# Altium schematic sheet HVPS - LT3751.SchDoc
size 584 x 381 mm; SheetNumber: 1; SheetTotal: 1
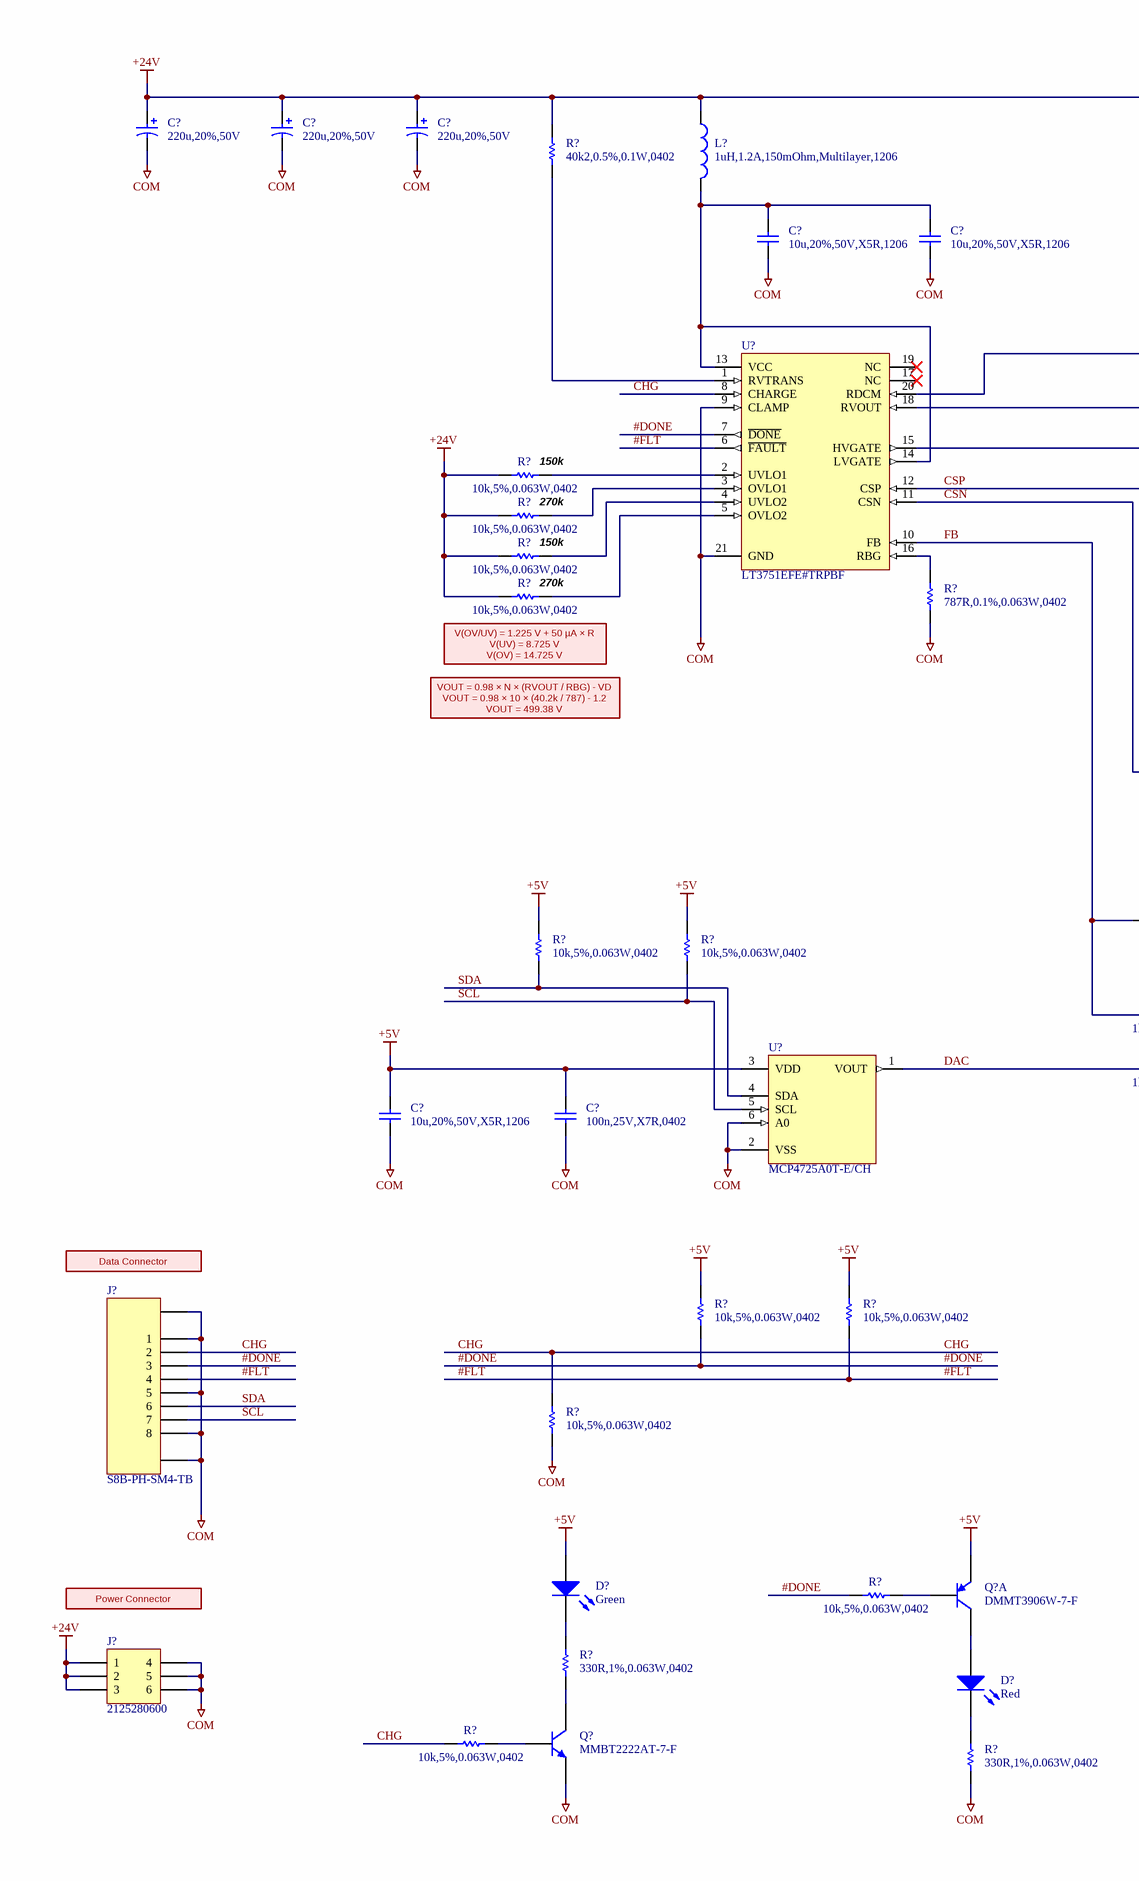
[diagram p0: HVPS - LT3751.SchDoc, left]
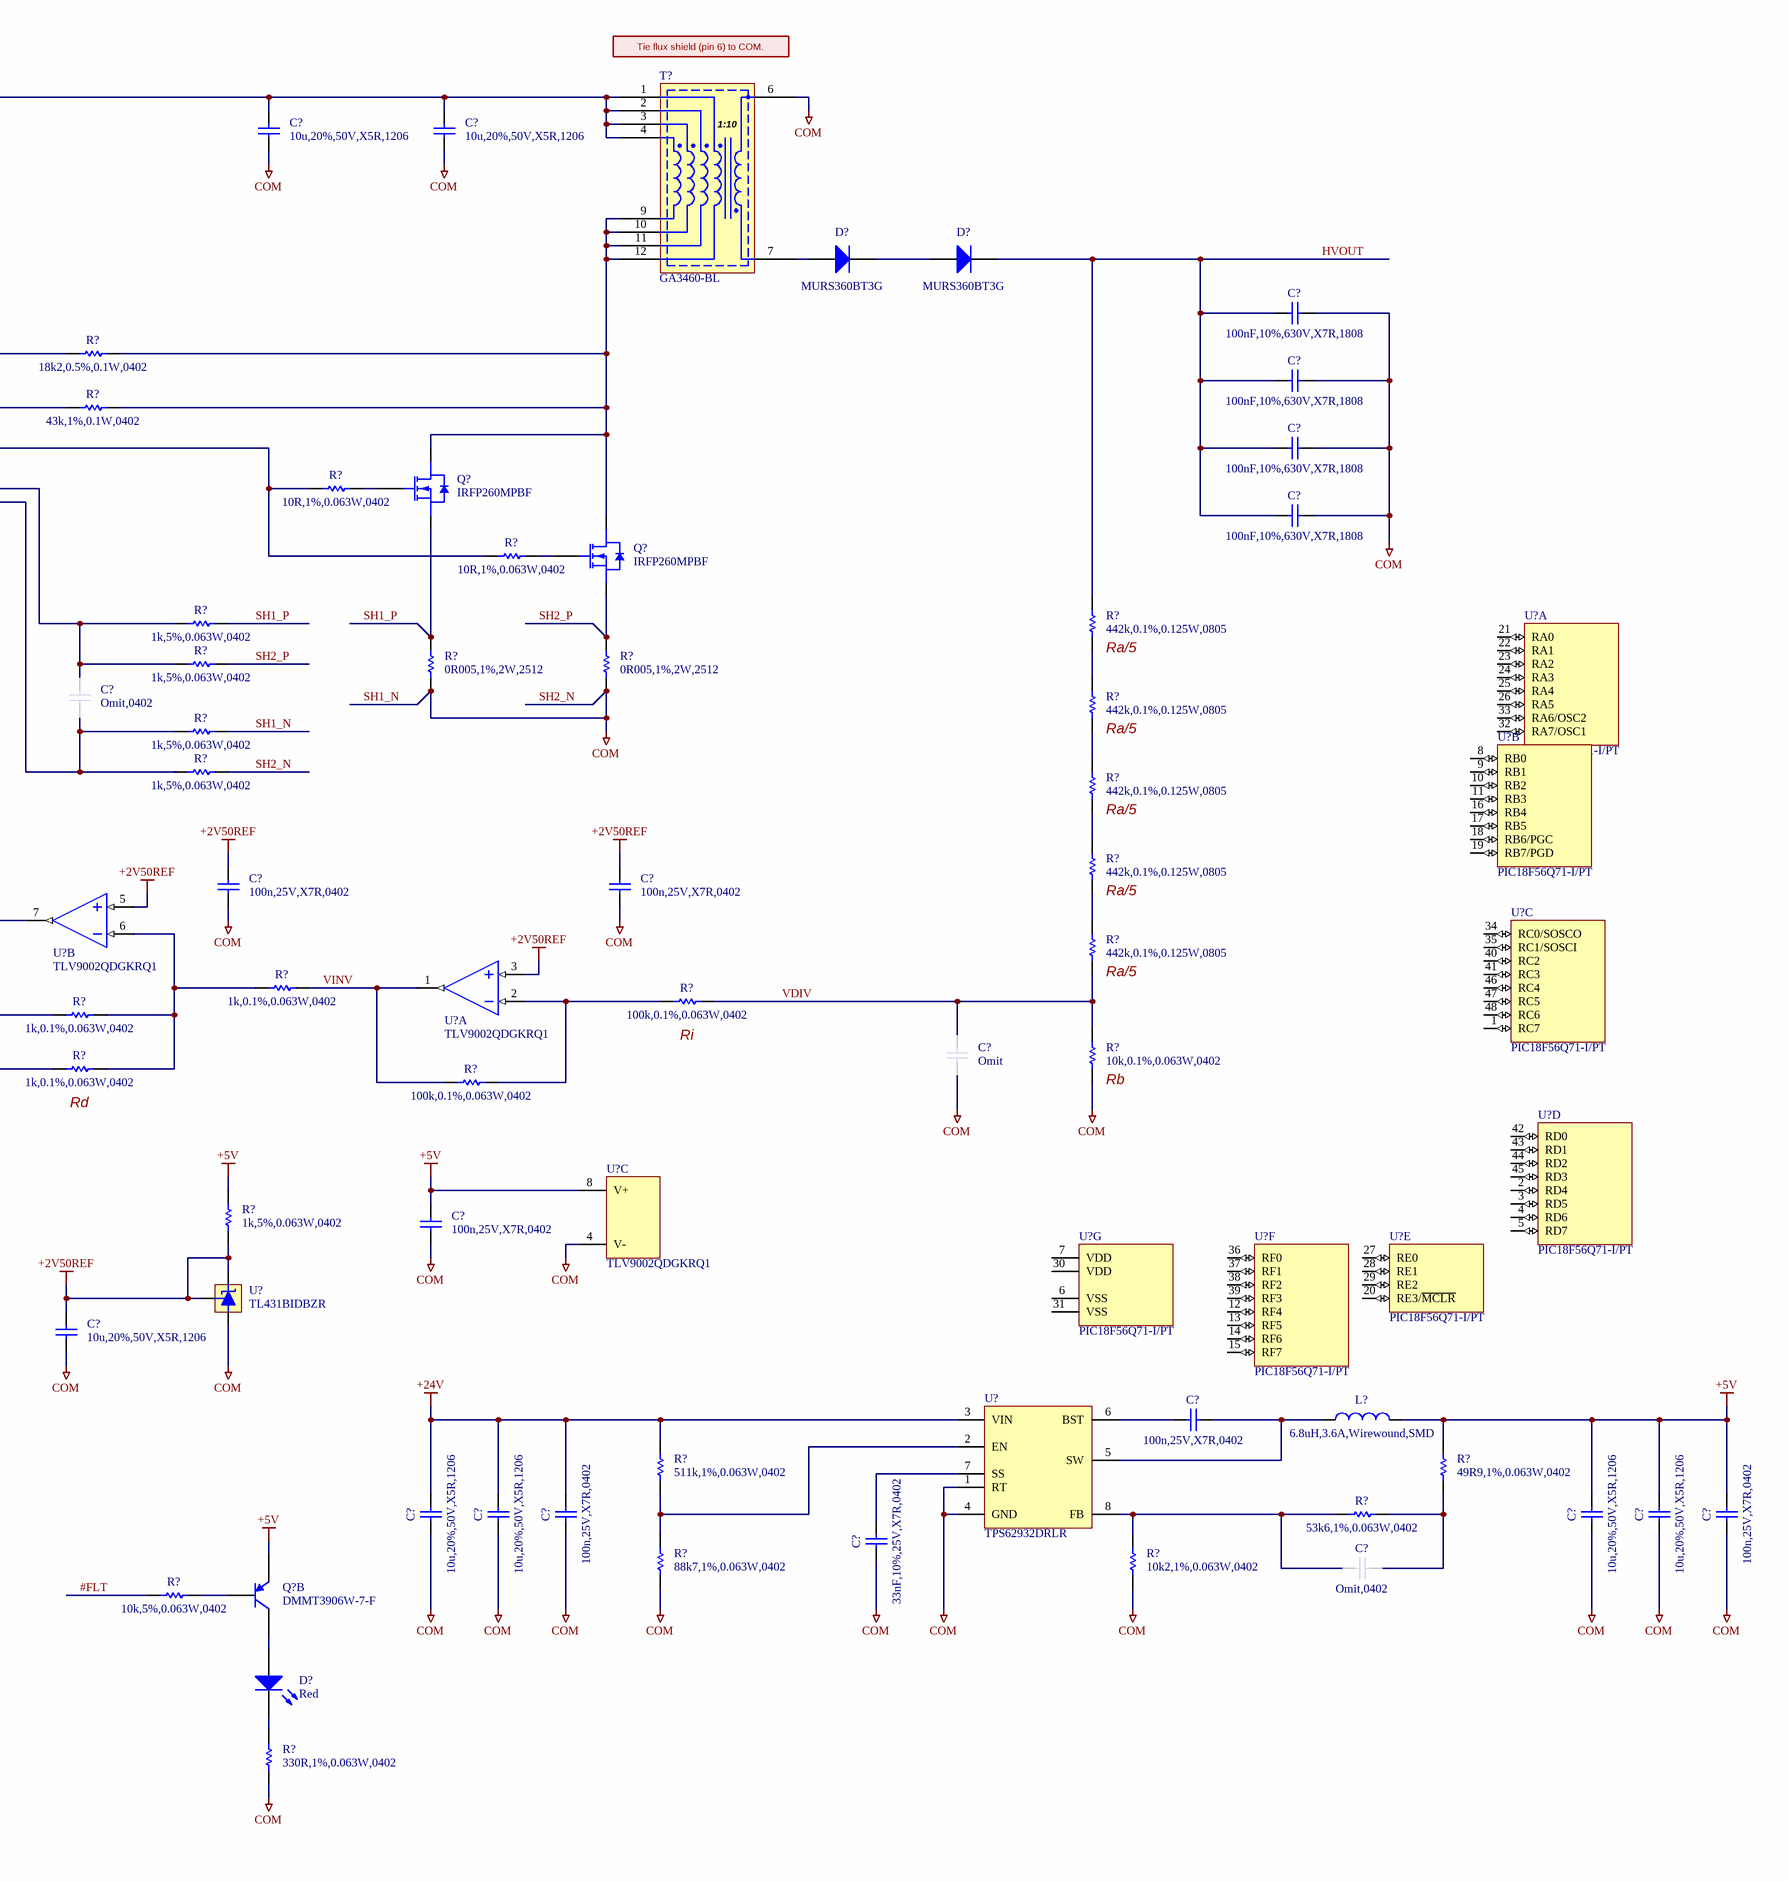
[diagram p1: HVPS - LT3751.SchDoc, right]

## Parts
(Parts that share a designator on the sheet are numbered #1, #2 ... from top to bottom, then left to right.)
C?#1  220u,20%,50V  [CAPPR500W60D1000H1600B]
C?#2  220u,20%,50V  [CAPPR500W60D1000H1600B]
C?#3  220u,20%,50V  [CAPPR500W60D1000H1600B]
C?#4  10u,20%,50V,X5R,1206  [CAPC3216X16N]
C?#5  10u,20%,50V,X5R,1206  [CAPC3216X16N]
C?#6  10u,20%,50V,X5R,1206  [CAPC3216X16N]
C?#7  10u,20%,50V,X5R,1206  [CAPC3216X16N]
C?#8  100nF,10%,630V,X7R,1808  [KEMET_PKG_LC]
C?#9  100nF,10%,630V,X7R,1808  [KEMET_PKG_LC]
C?#10  100nF,10%,630V,X7R,1808  [KEMET_PKG_LC]
C?#11  100nF,10%,630V,X7R,1808  [KEMET_PKG_LC]
C?#12  Omit,0402  [CAPC1005X06N]  (no BOM)
C?#13  100n,25V,X7R,0402  [CAPC1005X06N]
C?#14  100n,25V,X7R,0402  [CAPC1005X06N]
C?#15  Omit  [CAPC_0805]  (no BOM)
C?#16  10u,20%,50V,X5R,1206  [CAPC3216X16N]
C?#17  100n,25V,X7R,0402  [CAPC1005X06N]
C?#18  100n,25V,X7R,0402  [CAPC1005X06N]
C?#19  10u,20%,50V,X5R,1206  [CAPC3216X16N]
C?#20  100n,25V,X7R,0402  [CAPC1005X06N]
C?#21  10u,20%,50V,X5R,1206  [CAPC3216X16N]
C?#22  10u,20%,50V,X5R,1206  [CAPC3216X16N]
C?#23  100n,25V,X7R,0402  [CAPC1005X06N]
C?#24  10u,20%,50V,X5R,1206  [CAPC3216X16N]
C?#25  10u,20%,50V,X5R,1206  [CAPC3216X16N]
C?#26  100n,25V,X7R,0402  [CAPC1005X06N]
C?#27  33nF,10%,25V,X7R,0402  [CAPC1005X06N]
C?#28  Omit,0402  [CAPC1005X06N]  (no BOM)
D?#1  MURS360BT3G  [ONSEMI_SMB]
D?#2  MURS360BT3G  [ONSEMI_SMB]
D?#3  Green  [LITE-ON_LTST-C190KGKT]
D?#4  Red  [LITE-ON_LTST-C190KRKT]
D?#5  Red  [LITE-ON_LTST-C190KRKT]
J?#1  S8B-PH-SM4-TB  [JST_S8B-PH-SM4-TB]
J?#2  2125280600  [MOLEX_2125280600]
L?#1  1uH,1.2A,150mOhm,Multilayer,1206  [MURATA_LQM31]
L?#2  6.8uH,3.6A,Wirewound,SMD  [BOURNS_SRN6045TA-6R8M]
Q?#1  IRFP260MPBF  [INFINEON_PKG_TO247AD]
Q?#2  IRFP260MPBF  [INFINEON_PKG_TO247AD]
Q?#3  DMMT3906W-7-F  [DIODES_SOT363]  (part A of 2)
Q?#4  DMMT3906W-7-F  [DIODES_SOT363]  (part B of 2)
Q?#5  MMBT2222AT-7-F  [SOTFL50P160X90-3N]
R?#1  40k2,0.5%,0.1W,0402  [RESC1005X04N]
R?#2  18k2,0.5%,0.1W,0402  [RESC1005X04N]
R?#3  43k,1%,0.1W,0402  [RESC1005X04N]
R?#4  10k,5%,0.063W,0402  [RESC1005X04N]
R?#5  10R,1%,0.063W,0402  [RESC1005X04N]
R?#6  10k,5%,0.063W,0402  [RESC1005X04N]
R?#7  10k,5%,0.063W,0402  [RESC1005X04N]
R?#8  10R,1%,0.063W,0402  [RESC1005X04N]
R?#9  10k,5%,0.063W,0402  [RESC1005X04N]
R?#10  787R,0.1%,0.063W,0402  [RESC1005X04N]
R?#11  1k,5%,0.063W,0402  [RESC1005X04N]
R?#12  442k,0.1%,0.125W,0805  [RESC2012X07N]
R?#13  1k,5%,0.063W,0402  [RESC1005X04N]
R?#14  0R005,1%,2W,2512  [OHMITE_PKG_MCS3264]
R?#15  0R005,1%,2W,2512  [OHMITE_PKG_MCS3264]
R?#16  442k,0.1%,0.125W,0805  [RESC2012X07N]
R?#17  1k,5%,0.063W,0402  [RESC1005X04N]
R?#18  1k,5%,0.063W,0402  [RESC1005X04N]
R?#19  442k,0.1%,0.125W,0805  [RESC2012X07N]
R?#20  442k,0.1%,0.125W,0805  [RESC2012X07N]
R?#21  10k,5%,0.063W,0402  [RESC1005X04N]
R?#22  10k,5%,0.063W,0402  [RESC1005X04N]
R?#23  442k,0.1%,0.125W,0805  [RESC2012X07N]
R?#24  1k,0.1%,0.063W,0402  [RESC1005X04N]
R?#25  100k,0.1%,0.063W,0402  [RESC1005X04N]
R?#26  1k,0.1%,0.063W,0402  [RESC1005X04N]
R?#27  10k,0.1%,0.063W,0402  [RESC1005X04N]
R?#28  1k,0.1%,0.063W,0402  [RESC1005X04N]
R?#29  100k,0.1%,0.063W,0402  [RESC1005X04N]
R?#30  1k,5%,0.063W,0402  [RESC1005X04N]
R?#31  10k,5%,0.063W,0402  [RESC1005X04N]
R?#32  10k,5%,0.063W,0402  [RESC1005X04N]
R?#33  10k,5%,0.063W,0402  [RESC1005X04N]
R?#34  511k,1%,0.063W,0402  [RESC1005X04N]
R?#35  49R9,1%,0.063W,0402  [RESC1005X04N]
R?#36  53k6,1%,0.063W,0402  [RESC1005X04N]
R?#37  88k7,1%,0.063W,0402  [RESC1005X04N]
R?#38  10k2,1%,0.063W,0402  [RESC1005X04N]
R?#39  10k,5%,0.063W,0402  [RESC1005X04N]
R?#40  10k,5%,0.063W,0402  [RESC1005X04N]
R?#41  330R,1%,0.063W,0402  [RESC1005X04N]
R?#42  10k,5%,0.063W,0402  [RESC1005X04N]
R?#43  330R,1%,0.063W,0402  [RESC1005X04N]
R?#44  330R,1%,0.063W,0402  [RESC1005X04N]
T?  GA3460-BL  [COILCRAFT_GA3460-BL]
U?#1  LT3751EFE#TRPBF  [ANALOGDEVICES_FE]
U?#2  PIC18F56Q71-I/PT  [TSQFP50P900X900X120-48N]  (part A of 7)
U?#3  PIC18F56Q71-I/PT  [TSQFP50P900X900X120-48N]  (part B of 7)
U?#4  TLV9002QDGKRQ1  [SOP65P490X110-8]  (part B of 3)
U?#5  PIC18F56Q71-I/PT  [TSQFP50P900X900X120-48N]  (part C of 7)
U?#6  TLV9002QDGKRQ1  [SOP65P490X110-8]  (part A of 3)
U?#7  MCP4725A0T-E/CH  [SOTFL95P260X145-6]
U?#8  PIC18F56Q71-I/PT  [TSQFP50P900X900X120-48N]  (part D of 7)
U?#9  TLV9002QDGKRQ1  [SOP65P490X110-8]  (part C of 3)
U?#10  PIC18F56Q71-I/PT  [TSQFP50P900X900X120-48N]  (part G of 7)
U?#11  PIC18F56Q71-I/PT  [TSQFP50P900X900X120-48N]  (part F of 7)
U?#12  PIC18F56Q71-I/PT  [TSQFP50P900X900X120-48N]  (part E of 7)
U?#13  TL431BIDBZR  [SOT95P240X120-3N]
U?#14  TPS62932DRLR  [TEXASINSTRUMENTS_PKG_DRL0008A]

## Nets
+2V50REF: C?#13.2 C?#14.2 C?#19.2 R?#30.1 U?#4.5(IN2+) U?#6.3(IN1+) U?#13.1 U?#13.2
+5V: C?#16.2 C?#17.2 C?#18.2 C?#24.2 C?#25.2 C?#26.2 D?#3.A L?#2.2 Q?#3.4(E1) Q?#4.5(E2) R?#21.2 R?#22.2 R?#30.2 R?#31.2 R?#32.2 R?#35.2 U?#7.3(VDD) U?#9.8(V+)
+24V: C?#1.1 C?#2.1 C?#3.1 C?#4.2 C?#5.2 C?#21.2 C?#22.2 C?#23.2 J?#2.1 J?#2.2 J?#2.3 L?#1.1 R?#1.2 R?#4.1 R?#6.1 R?#7.1 R?#9.1 R?#34.2 T?.1 T?.2 T?.3 T?.4 U?#14.3(VIN)
SH1_N: C?#1.2 C?#2.2 C?#3.2 C?#4.1 C?#5.1 C?#6.1 C?#7.1 C?#8.1 C?#9.1 C?#10.1 C?#11.1 C?#13.1 C?#14.1 C?#15.1 C?#16.1 C?#17.1 C?#18.1 C?#19.1 C?#21.1 C?#22.1 C?#23.1 C?#24.1 C?#25.1 C?#26.1 C?#27.1 J?#1.0 J?#1.1 J?#1.5 J?#1.8 J?#2.4 J?#2.5 J?#2.6 Q?#5.2(E) R?#10.1 R?#14.1 R?#15.1 R?#17.2 R?#18.2 R?#27.1 R?#33.1 R?#37.1 R?#38.1 R?#43.1 R?#44.1 T?.6 U?#1.9(CLAMP) U?#1.21(GND) U?#7.2(VSS) U?#7.6(A0) U?#9.4(V-) U?#13.3 U?#14.1(RT) U?#14.4(GND)  [also labelled COM, SH2_N]
#DONE: J?#1.3 R?#31.1 R?#39.2 U?#1.7(~{DONE})
#FLT: J?#1.4 R?#32.1 R?#40.2 U?#1.6(~{FAULT})
CHG: J?#1.2 R?#33.2 R?#42.2 U?#1.8(CHARGE)
CSN: C?#12.1 R?#17.1 R?#18.1 U?#1.11(CSN)
CSP: C?#12.2 R?#11.1 R?#13.1 U?#1.12(CSP)
DAC: R?#28.2 U?#7.1(VOUT)
FB: R?#26.1 U?#1.10(FB) U?#4.7(OUT2)
HVOUT: C?#8.2 C?#9.2 C?#10.2 C?#11.2 D?#2.1(K) R?#12.2
SCL: J?#1.7 R?#22.1 U?#7.5(SCL)
SDA: J?#1.6 R?#21.1 U?#7.4(SDA)
SH1_P: Q?#1.3(S) R?#11.2 R?#14.2
SH2_P: Q?#2.3(S) R?#13.2 R?#15.2
VDIV: C?#15.2 R?#23.1 R?#25.2 R?#27.2
VINV: R?#24.2 R?#29.1 U?#6.1(OUT1)
NetC?#6_2: C?#6.2 C?#7.2 L?#1.2 U?#1.13(VCC) U?#1.14(LVGATE)
NetC?#20_1: C?#20.1 L?#2.1 U?#14.5(SW)
NetC?#20_2: C?#20.2 U?#14.6(BST)
NetC?#27_2: C?#27.2 U?#14.7(SS)
NetC?#28_1: C?#28.1 R?#36.2 R?#38.2 U?#14.8(FB)
NetC?#28_2: C?#28.2 R?#35.1 R?#36.1
NetD?#1_1: D?#1.1(K) D?#2.2(A)
NetD?#1_2: D?#1.2(A) T?.7
NetD?#3_C: D?#3.C R?#41.2
NetD?#4_A: D?#4.A Q?#3.3(C1)
NetD?#4_C: D?#4.C R?#43.2
NetD?#5_A: D?#5.A Q?#4.6(C2)
NetD?#5_C: D?#5.C R?#44.2
NetQ?#1_1: Q?#1.1(G) R?#5.2
NetQ?#1_2: Q?#1.2(D) Q?#2.2(D) R?#2.2 R?#3.2 T?.9 T?.10 T?.11 T?.12
NetQ?#2_1: Q?#2.1(G) R?#8.2
NetQ?#3_2: Q?#3.2(B1) R?#39.1
NetQ?#4_1: Q?#4.1(B2) R?#40.1
NetQ?#5_1: Q?#5.1(B) R?#42.1
NetQ?#5_3: Q?#5.3(C) R?#41.1
NetR?#1_1: R?#1.1 U?#1.1(RVTRANS)
NetR?#2_1: R?#2.1 U?#1.20(RDCM)
NetR?#3_1: R?#3.1 U?#1.18(RVOUT)
NetR?#4_2: R?#4.2 U?#1.2(UVLO1)
NetR?#5_1: R?#5.1 R?#8.1 U?#1.15(HVGATE)
NetR?#6_2: R?#6.2 U?#1.3(OVLO1)
NetR?#7_2: R?#7.2 U?#1.4(UVLO2)
NetR?#9_2: R?#9.2 U?#1.5(OVLO2)
NetR?#10_2: R?#10.2 U?#1.16(RBG)
NetR?#12_1: R?#12.1 R?#16.2
NetR?#16_1: R?#16.1 R?#19.2
NetR?#19_1: R?#19.1 R?#20.2
NetR?#20_1: R?#20.1 R?#23.2
NetR?#24_1: R?#24.1 R?#26.2 R?#28.1 U?#4.6(IN2-)
NetR?#25_1: R?#25.1 R?#29.2 U?#6.2(IN1-)
NetR?#34_1: R?#34.1 R?#37.2 U?#14.2(EN)

Not connected (* = marked no-connect by the designer): U?#1 17(NC)* 19(NC)*; U?#2 21(RA0) 22(RA1) 23(RA2) 24(RA3) 25(RA4) 26(RA5) 32(RA7/OSC1) 33(RA6/OSC2); U?#3 8(RB0) 9(RB1) 10(RB2) 11(RB3) 16(RB4) 17(RB5) 18(RB6/PGC) 19(RB7/PGD); U?#5 1(RC7) 34(RC0/SOSCO) 35(RC1/SOSCI) 40(RC2) 41(RC3) 46(RC4) 47(RC5) 48(RC6); U?#8 2(RD4) 3(RD5) 4(RD6) 5(RD7) 42(RD0) 43(RD1) 44(RD2) 45(RD3); U?#10 6(VSS) 7(VDD) 30(VDD) 31(VSS); U?#11 12(RF4) 13(RF5) 14(RF6) 15(RF7) 36(RF0) 37(RF1) 38(RF2) 39(RF3); U?#12 20(RE3/~{MCLR}) 27(RE0) 28(RE1) 29(RE2)

## Notes on the sheet
- (near T?) Tie flux shield (pin 6) to COM.
- (near R?#4) 150k
- (near R?#6) 270k
- (near R?#7) 150k
- (near R?#9) 270k
- (near R?#9) V(OV/UV) = 1.225 V + 50 µA × R
  V(UV) = 8.725 V
  V(OV) = 14.725 V
- (near R?#12) Ra/5
- VOUT = 0.98 × N × (RVOUT / RBG) - VD
  VOUT = 0.98 × 10 × (40.2k / 787) - 1.2
  VOUT = 499.38 V
- (near R?#16) Ra/5
- (near R?#19) Ra/5
- (near R?#20) Ra/5
- (near R?#23) Ra/5
- (near R?#25) Ri
- (near R?#28) Rd
- (near R?#27) Rb
- (near J?#1) Data Connector
- Power Connector
- (in symbol XFR,Flyback,COILCRAFT_GA3460-BL) 1:10

## Library data of the parts
C?#1-C?#3 = CAP,Alum,220uF,20%,50VDC,Radial,Thru: 220 ï¿½F 50 V Aluminum Electrolytic Capacitors Radial, Can 5000 Hrs @ 105ï¿½C; Manufacturer 1: Rubycon; Manufacturer 1 Part Number: 50YXG220MEFCT810X16; Vendor 1 Part Number: 1189-3771-1-ND; Vendor 1: Digikey; Part Name: CAP,Alum,220uF,20%,50VDC,Radial,Thru; CreatedBy: Judd Foster; HelpURL: https://www.rubycon.co.jp/wp-content/uploads/catalog-aluminum/YXG.pdf; Value: 220u
C?#4-C?#7 C?#16 C?#19 C?#21 C?#22 C?#24 C?#25 = CAP,Cer,10uF,50VDC,X5R,1206: 10ï¿½F ï¿½20% 50V Ceramic Capacitor X5R 1206 (3216 Metric); Manufacturer 1: Samsung Electro-Mechanics; Manufacturer 1 Part Number: CL31A106MBHNNNE; Vendor 1 Part Number: 1276-6736-1-ND; Vendor 1: Digikey; Part Name: CAP,Cer,10uF,50VDC,X5R,1206; CreatedBy: Judd Foster; HelpURL: https://www.samsungsem.com/resources/file/global/support/product_catalog/MLCC.pdf; Value: 10u
C?#8-C?#11 = CAP,Cer,100nF,10%,630V,X7R,1808: 0.1 ÂµF Â±10% 630V Ceramic Capacitor X7R 1808 (4520 Metric); Manufacturer 1: KEMET; Manufacturer 1 Part Number: C1808C104KBRAC7800; Vendor 1 Part Number: 399-C1808C104KBRAC7800CT-ND; Vendor 1: DigiKey; Part Name: CAP,Cer,100nF,10%,630V,X7R,1808; CreatedBy: Judd Foster; HelpURL: https://content.kemet.com/datasheets/KEM_C1010_X7R_HV_SMD.pdf; Value: 100nF
C?#12 C?#28 = CAP,Omit,0402: Omit; Part Name: CAP,Omit,0402; CreatedBy: Judd Foster; HelpURL: N/A; Manufacturer 1: N/A; Manufacturer 1 Part Number: N/A; Vendor 1: N/A; Vendor 1 Part Number: N/A; Value: Omit
C?#13 C?#14 C?#17 C?#18 C?#20 C?#23 C?#26 = CAP,Cer,100nF,25VDC,X7R,0402: 0.1ï¿½F ï¿½10% 25V Ceramic Capacitor X7R 0402 (1005 Metric); Manufacturer 1: Murata Electronics; Manufacturer 1 Part Number: GRM155R71E104KE14J; Vendor 1 Part Number: 490-14603-1-ND; Vendor 1: Digikey; Part Name: CAP,Cer,100nF,25VDC,X7R,0402; CreatedBy: Judd Foster; HelpURL: https://search.murata.co.jp/Ceramy/image/img/A01X/G101/ENG/GRM155R71E104KE14-01.pdf; Value: 100n
C?#15 = CAP,Omit,0805: Part Name: CAP,Omit,0805; CreatedBy: Judd Foster; HelpURL: N/A; Manufacturer 1: N/A; Manufacturer 1 Part Number: N/A; Vendor 1: N/A; Vendor 1 Part Number: N/A; Value: Omit
C?#27 = CAP,Cer,33nF,10%,25V,X7R,0402: 0.033 ÂµF Â±10% 25V Ceramic Capacitor X7R 0402 (1005 Metric); Manufacturer 1: Murata Electronics; Manufacturer 1 Part Number: GRM155R71E333KA88D; Vendor 1 Part Number: 490-3253-1-ND; Vendor 1: DigiKey; Part Name: CAP,Cer,33nF,10%,25V,X7R,0402; CreatedBy: Judd Foster; HelpURL: https://search.murata.co.jp/Ceramy/image/img/A01X/G101/ENG/GRM155R71E333KA88-01.pdf; Value: 33nF
D?#1 D?#2 = Diode,Gen,600V,3A,SMB: Diode 600 V 3A Surface Mount SMB; Manufacturer 1: onsemi; Vendor 1 Part Number: MURS360BT3GOSCT-ND; Vendor 1: Digikey; Part Name: Diode,Gen,600V,3A,SMB; CreatedBy: Judd Foster; HelpURL: https://www.onsemi.com/pdf/datasheet/murs360bt3-d.pdf; Manufacturer 1 Part Number: MURS360BT3G
D?#3 = LED,Green,SMD,0603: Green 571nm LED Indication - Discrete 2V 0603 (1608 Metric); Manufacturer 1: Lite-On Inc.; Manufacturer 1 Part Number: LTST-C190KGKT; Vendor 1 Part Number: 160-1435-1-ND; Vendor 1: Digikey; Part Name: LED,Green,SMD,0603; CreatedBy: Judd Foster; HelpURL: https://optoelectronics.liteon.com/upload/download/DS22-2000-074/LTST-C190KGKT.PDF; Value: Green
D?#4 D?#5 = LED,Red,SMD,0603: Red 631nm LED Indication - Discrete 2V 0603 (1608 Metric); Manufacturer 1: Lite-On Inc.; Manufacturer 1 Part Number: LTST-C190KRKT; Vendor 1 Part Number: 160-1436-1-ND; Vendor 1: Digikey; Part Name: LED,Red,SMD,0603; CreatedBy: Judd Foster; HelpURL: https://optoelectronics.liteon.com/upload/download/DS-22-99-0151/LTST-C190KRKT.pdf; Value: Red
J?#1 = CONN,JST,8 Pin,2mm,RA,SMD: Connector Header Surface Mount, Right Angle 8 position 0.079" (2.00mm); Manufacturer 1: JST Sales America Inc.; Vendor 1 Part Number: 455-S8B-PH-SM4-TBCT-ND; Vendor 1: DigiKey; Part Name: CONN,JST,8 Pin,2mm,RA,SMD; CreatedBy: Judd Foster; HelpURL: https://www.jst-mfg.com/product/pdf/eng/ePH.pdf; Manufacturer 1 Part Number: S8B-PH-SM4-TB
J?#2 = Conn,Micro-Fit,Hdr,6Pos,RA,Thru: Connector Header Through Hole, Right Angle 6 position 0.118" (3.00mm); Manufacturer 1: Molex; Vendor 1 Part Number: 900-2125280600-ND; Vendor 1: Digikey; Part Name: Conn,Micro-Fit,Hdr,6Pos,RA,Thru; CreatedBy: Judd Foster; HelpURL: https://www.molex.com/webdocs/datasheets/pdf/en-us/2125280600_PCB_HEADERS.pdf; Manufacturer 1 Part Number: 2125280600
L?#1 = IND,1uH,1.2A,150mOhm,Multilayer,1206: 1 ÂµH Shielded Multilayer Inductor 1.2 A 150mOhm Max 1206 (3216 Metric); Manufacturer 1: Murata Electronics; Manufacturer 1 Part Number: LQM31PN1R0M00L; Vendor 1 Part Number: 490-4039-1-ND; Vendor 1: Digikey; Value: 1u; Part Name: IND,1uH,1.2A,150mOhm,Multilayer,1206; CreatedBy: Judd Foster; HelpURL: https://search.murata.co.jp/Ceramy/image/img/P02/JELF243B-0013.pdf
L?#2 = IND,6.8uH,3.6A,Wirewound,SMD: 6.8 ÂµH Semi-Shielded Drum Core, Wirewound Inductor 3.6 A 34mOhm Nonstandard; Manufacturer 1: Bourns Inc.; Manufacturer 1 Part Number: SRN6045TA-6R8M; Vendor 1 Part Number: SRN6045TA-6R8MCT-ND; Vendor 1: DigiKey; Part Name: IND,6.8uH,3.6A,Wirewound,SMD; CreatedBy: Judd Foster; HelpURL: https://www.bourns.com/docs/Product-Datasheets/SRN6045TA.pdf; Value: 6.8uH
Q?#1 Q?#2 = MOSFET,N Ch,200V,50A,IRFP260MPBF: N-Channel 200 V 50A (Tc) 300W (Tc) Through Hole TO-247AC; Manufacturer 1: Infineon Technologies; Vendor 1 Part Number: IRFP260MPBF-ND; Vendor 1: DigiKey; Part Name: MOSFET,N Ch,200V,50A,IRFP260MPBF; CreatedBy: Judd Foster; HelpURL: https://www.infineon.com/dgdl/irfp260mpbf.pdf?fileId=5546d462533600a40153562894e91fe0; Manufacturer 1 Part Number: IRFP260MPBF
Q?#3 Q?#4 = Trans,PNP,Dual,40V,200mA,SOT363: Bipolar (BJT) Transistor Array 2 PNP (Dual) Matched Pair 40V 200mA 250MHz 200mW Surface Mount SOT-363; Manufacturer 1: Diodes Incorporated; Vendor 1 Part Number: DMMT3906W-FDICT-ND; Vendor 1: Digikey; Part Name: Trans,PNP,Dual,40V,200mA,SOT363; CreatedBy: Judd Foster; HelpURL: https://www.diodes.com/assets/Datasheets/ds30312.pdf; Manufacturer 1 Part Number: DMMT3906W-7-F
Q?#5 = Trans,NPN,40V,600mA,SOT523: Bipolar (BJT) Transistor NPN 40 V 600 mA 300MHz 150 mW Surface Mount SOT-523; Manufacturer 1: Diodes Incorporated; Vendor 1 Part Number: MMBT2222AT-FDICT-ND; Vendor 1: Digikey; Part Name: Trans,NPN,40V,600mA,SOT523; CreatedBy: Judd Foster; HelpURL: https://media.digikey.com/pdf/Data%20Sheets/Diodes%20PDFs/MMBT2222AT_Rev2016.pdf; Manufacturer 1 Part Number: MMBT2222AT-7-F
R?#1 = RES,40k2,0.5%,0.1W,0402: 40.2 kOhms Â±0.5% 0.1W, 1/10W Chip Resistor 0402 (1005 Metric) Automotive AEC-Q200 Thin Film; Manufacturer 1: Stackpole Electronics Inc; Manufacturer 1 Part Number: RNCF0402DTE40K2; Vendor 1 Part Number: RNCF0402DTE40K2CT-ND; Vendor 1: Digikey; Part Name: RES,40k2,0.5%,0.1W,0402; CreatedBy: Judd Foster; HelpURL: https://www.seielect.com/catalog/sei-rncf.pdf; Value: 40k2
R?#2 = RES,18k2,0.5%,0.1W,0402: 18.2 kOhms Â±0.5% 0.1W, 1/10W Chip Resistor 0402 (1005 Metric) Automotive AEC-Q200 Thin Film; Manufacturer 1: Stackpole Electronics Inc; Manufacturer 1 Part Number: RNCF0402DTE18K2; Vendor 1 Part Number: RNCF0402DTE18K2CT-ND; Vendor 1: Digikey; Part Name: RES,18k2,0.5%,0.1W,0402; CreatedBy: Judd Foster; HelpURL: https://www.seielect.com/catalog/sei-rncf.pdf; Value: 18k2
R?#3 = RES,43k,1%,0.1W,0402: 43 kOhms Â±1% 0.1W, 1/10W Chip Resistor 0603 (1608 Metric) Automotive AEC-Q200 Thick Film; Manufacturer 1: Stackpole Electronics Inc; Manufacturer 1 Part Number: RMCF0603FT43K0; Vendor 1 Part Number: RMCF0603FT43K0CT-ND; Vendor 1: DigiKey; Part Name: RES,43k,1%,0.1W,0402; CreatedBy: Judd Foster; HelpURL: https://www.seielect.com/catalog/sei-rmcf_rmcp.pdf; Value: 43k
R?#4 R?#6 R?#7 R?#9 R?#21 R?#22 R?#31-R?#33 R?#39 R?#40 R?#42 = RES,10k,5%,0.063W,0402: 10 kOhms ï¿½5% 0.063W, 1/16W Chip Resistor 0402 (1005 Metric) Automotive AEC-Q200 Thick Film; Manufacturer 1: Stackpole Electronics Inc; Manufacturer 1 Part Number: RMCF0402JT10K0; Vendor 1 Part Number: RMCF0402JT10K0CT-ND; Vendor 1: DIgikey; Part Name: RES,10k,5%,0.063W,0402; CreatedBy: Judd Foster; HelpURL: https://www.seielect.com/catalog/sei-rmcf_rmcp.pdf; Value: 10k
R?#5 R?#8 = RES,10R,1%,0.063W,0402: 10 Ohms ï¿½1% 0.063W, 1/16W Chip Resistor 0402 (1005 Metric) Automotive AEC-Q200 Thick Film; Manufacturer 1: Panasonic Electronic Components; Manufacturer 1 Part Number: ERJ-2RKF10R0X; Vendor 1 Part Number: P10.0LCT-ND; Vendor 1: Digikey; Part Name: RES,10R,1%,0.063W,0402; CreatedBy: Judd Foster; HelpURL: https://industrial.panasonic.com/cdbs/www-data/pdf/RDA0000/AOA0000C304.pdf; Value: 10R
R?#10 = RES,787R,0.1%,0.063W,0402: 787 Ohms Â±0.1% 0.063W, 1/16W Chip Resistor 0402 (1005 Metric) Thin Film; Manufacturer 1: YAGEO; Manufacturer 1 Part Number: RT0402BRD07787RL; Vendor 1 Part Number: YAG4310CT-ND; Vendor 1: DigiKey; Part Name: RES,787R,0.1%,0.063W,0402; CreatedBy: Judd Foster; HelpURL: https://www.yageo.com/upload/media/product/app/datasheet/rchip/pyu-rt_1-to-0.01_rohs_l.pdf; Value: 787R
R?#11 R?#13 R?#17 R?#18 R?#30 = RES,1k,5%,0.063W,0402: 1 kOhms ï¿½5% 0.063W, 1/16W Chip Resistor 0402 (1005 Metric) Automotive AEC-Q200 Thick Film; Manufacturer 1: Stackpole Electronics Inc; Manufacturer 1 Part Number: RMCF0402JT1K00; Vendor 1 Part Number: RMCF0402JT1K00CT-ND; Vendor 1: DIgikey; Part Name: RES,1k,5%,0.063W,0402; CreatedBy: Judd Foster; HelpURL: https://www.seielect.com/catalog/sei-rmcf_rmcp.pdf; Value: 1k
R?#12 R?#16 R?#19 R?#20 R?#23 = RES,442k,0.1%,0.125W,0805: 442 kOhms Â±0.1% 0.125W, 1/8W Chip Resistor 0805 (2012 Metric) Automotive AEC-Q200 Thin Film; Manufacturer 1: Panasonic Electronic Components; Manufacturer 1 Part Number: ERA-6AEB4423V; Vendor 1 Part Number: P442KDACT-ND; Vendor 1: DigiKey; Part Name: RES,442k,0.1%,0.125W,0805; CreatedBy: Judd Foster; HelpURL: https://industrial.panasonic.com/cdbs/www-data/pdf/RDM0000/AOA0000C307.pdf; Value: 442k
R?#14 R?#15 = RES,0R005,1%,2W,2512: 5 mOhms Â±1% 2W Chip Resistor 2512 (6432 Metric) Current Sense, Flame Retardant Coating, Safety Metal Element; Manufacturer 1: Ohmite; Manufacturer 1 Part Number: MCS3264R005FER; Vendor 1 Part Number: MCS3264R005FERCT-ND; Vendor 1: DigiKey; Value: 5m; Part Name: RES,0R005,1%,2W,2512; CreatedBy: Judd Foster; HelpURL: https://www.ohmite.com/assets/images/res-mcs.pdf
R?#24 R?#26 R?#28 = RES,1k,0.1%,0.063W,0402: 1 kOhms Â±0.1% 0.063W, 1/16W Chip Resistor 0402 (1005 Metric) Thin Film; Manufacturer 1: YAGEO; Manufacturer 1 Part Number: RT0402BRE071KL; Vendor 1 Part Number: YAG2306CT-ND; Vendor 1: DigiKey; Part Name: RES,1k,0.1%,0.063W,0402; CreatedBy: Judd Foster; HelpURL: https://www.yageo.com/upload/media/product/app/datasheet/rchip/pyu-rt_1-to-0.01_rohs_l.pdf; Value: 1k
R?#25 R?#29 = RES,100k,0.1%,0.063W,0402: 100 kOhms ï¿½0.1% 0.063W, 1/16W Chip Resistor 0402 (1005 Metric) Thin Film; Manufacturer 1: YAGEO; Manufacturer 1 Part Number: RT0402BRE07100KL; Vendor 1 Part Number: YAG2304CT-ND; Vendor 1: Digikey; Part Name: RES,100k,0.1%,0.063W,0402; CreatedBy: Judd Foster; HelpURL: https://www.yageo.com/upload/media/product/app/datasheet/rchip/pyu-rt_1-to-0.01_rohs_l.pdf; Value: 100k
R?#27 = RES,10k,0.1%,0.063W,0402: 10 kOhms ï¿½0.1% 0.1W, 1/10W Chip Resistor 0402 (1005 Metric) Automotive AEC-Q200 Thin Film; Manufacturer 1: Stackpole Electronics Inc; Manufacturer 1 Part Number: RNCF0402BTE10K0; Vendor 1 Part Number: RNCF0402BTE10K0CT-ND; Vendor 1: Digikey; Part Name: RES,10k,0.1%,0.063W,0402; CreatedBy: Judd Foster; HelpURL: https://www.seielect.com/catalog/sei-rncf.pdf; Value: 10k
R?#34 = RES,511k,1%,0.063W,0402: 511 kOhms Â±1% 0.063W, 1/16W Chip Resistor 0402 (1005 Metric) Moisture Resistant Thick Film; Manufacturer 1: YAGEO; Manufacturer 1 Part Number: RC0402FR-07511KL; Vendor 1 Part Number: YAG3176CT-ND; Vendor 1: DigiKey; Part Name: RES,511k,1%,0.063W,0402; CreatedBy: Judd Foster; HelpURL: https://www.yageo.com/upload/media/product/products/datasheet/rchip/PYu-RC_Group_51_RoHS_L_12.pdf; Value: 511k
R?#35 = RES,49R9,1%,0.063W,0402: 49.9 Ohms Â±1% 0.063W, 1/16W Chip Resistor 0402 (1005 Metric) Moisture Resistant Thick Film; Manufacturer 1: YAGEO; Manufacturer 1 Part Number: RC0402FR-0749R9L; Vendor 1 Part Number: 311-49.9LRCT-ND; Vendor 1: DigiKey; Part Name: RES,49R9,1%,0.063W,0402; CreatedBy: Judd Foster; HelpURL: https://www.yageo.com/upload/media/product/products/datasheet/rchip/PYu-RC_Group_51_RoHS_L_12.pdf; Value: 49R9
R?#36 = RES.53k6,1%,0.063W,0402: 53.6 kOhms Â±1% 0.063W, 1/16W Chip Resistor 0402 (1005 Metric) Moisture Resistant Thick Film; Manufacturer 1: YAGEO; Manufacturer 1 Part Number: RC0402FR-0753K6L; Vendor 1 Part Number: 311-53.6KLRCT-ND; Vendor 1: DigiKey; Part Name: RES.53k6,1%,0.063W,0402; CreatedBy: Judd Foster; HelpURL: https://www.yageo.com/upload/media/product/products/datasheet/rchip/PYu-RC_Group_51_RoHS_L_12.pdf; Value: 53k6
R?#37 = RES,88k7,1%,0.063W,0402: 88.7 kOhms Â±1% 0.063W, 1/16W Chip Resistor 0402 (1005 Metric) Automotive AEC-Q200, Moisture Resistant Thick Film; Manufacturer 1: YAGEO; Manufacturer 1 Part Number: AC0402FR-0788K7L; Vendor 1 Part Number: 13-AC0402FR-0788K7LCT-ND; Vendor 1: DigiKey; Part Name: RES,88k7,1%,0.063W,0402; CreatedBy: Judd Foster; HelpURL: https://www.yageo.com/upload/media/product/productsearch/datasheet/rchip/PYu-AC_51_RoHS_L_10.pdf; Value: 88k7
R?#38 = RES,10k2,1%,0.063W,0402: 10.2 kOhms Â±1% 0.063W, 1/16W Chip Resistor 0402 (1005 Metric) Moisture Resistant Thick Film; Manufacturer 1: YAGEO; Manufacturer 1 Part Number: RC0402FR-0710K2L; Vendor 1 Part Number: YAG2950CT-ND; Vendor 1: DigiKey; Part Name: RES,10k2,1%,0.063W,0402; CreatedBy: Judd Foster; HelpURL: https://www.yageo.com/upload/media/product/products/datasheet/rchip/PYu-RC_Group_51_RoHS_L_12.pdf; Value: 10k2
R?#41 R?#43 R?#44 = RES,330R,1%,0.063W,0402: 330 Ohms Â±1% 0.063W, 1/16W Chip Resistor 0402 (1005 Metric) Moisture Resistant Thick Film; Manufacturer 1: YAGEO; Manufacturer 1 Part Number: RC0402FR-07330RL; Vendor 1 Part Number: 311-330LRCT-ND; Vendor 1: DigiKey; Part Name: RES,330R,1%,0.063W,0402; CreatedBy: Judd Foster; HelpURL: https://www.yageo.com/upload/media/product/products/datasheet/rchip/PYu-RC_Group_51_RoHS_L_12.pdf; Value: 330R
T? = XFR,Flyback,COILCRAFT_GA3460-BL: Audio Transformers / Signal Transformers GA3460 for LT3751 500V 50A; Vendor 1 Part Number: 994-GA3460-BL; Vendor 1: Mouser; Part Name: XFR,Flyback,COILCRAFT_GA3460-BL; CreatedBy: Judd Foster; HelpURL: https://www.mouser.ca/datasheet/2/597/ga3459-463457.pdf; Manufacturer 1: Coilcraft; Manufacturer 1 Part Number: GA3460-BL
U?#1 = LT3751EFE#TRPBF: Photoflash Capacitor Charger PMIC 20-TSSOP-EP; Manufacturer 1: Analog Devices Inc.; Vendor 1 Part Number: LT3751EFE#TRPBFCT-ND; Vendor 1: Digikey; Part Name: LT3751EFE#TRPBF; CreatedBy: Judd Foster; HelpURL: https://www.analog.com/media/en/technical-documentation/data-sheets/lt3751.pdf; Manufacturer 1 Part Number: LT3751EFE#TRPBF
U?#2 U?#3 U?#5 U?#8 U?#10-U?#12 = PIC18F56Q71-I/PT: PIC PICï¿½ 18F Microcontroller IC 8-Bit 64MHz 64KB (64K x 8) FLASH 48-TQFP (7x7); Manufacturer 1: Microchip Technology; Vendor 1 Part Number: 150-PIC18F56Q71-I/PT-ND; Vendor 1: Digikey; Part Name: PIC18F56Q71-I/PT; CreatedBy: Judd Foster; HelpURL: https://ww1.microchip.com/downloads/aemDocuments/documents/MCU08/ProductDocuments/DataSheets/PIC18F26-46-56Q71-Microcontroller-Data-Sheet-DS40002329.pdf; Manufacturer 1 Part Number: PIC18F56Q71-I/PT
U?#4 U?#6 U?#9 = TLV9002QDGKRQ1: General Purpose Amplifier Circuit Rail-to-Rail 8-VSSOP; Manufacturer 1: Texas Instruments; Vendor 1 Part Number: 296-TLV9002QDGKRQ1CT-ND; Vendor 1: Digikey; Part Name: TLV9002QDGKRQ1; CreatedBy: Judd Foster; HelpURL: https://www.ti.com/lit/ds/symlink/tlv9001-q1.pdf?ts=1702270446565&ref_url=https%253A%252F%252Fwww.google.com%252F; Manufacturer 1 Part Number: TLV9002QDGKRQ1
U?#7 = MCP4725A0T-E/CH: 6us 12 I2C 2.7V~5.5V SOT-23-6 Digital To Analog Converters (DACs) ROHS; Manufacturer 1: Microchip; Vendor 1 Part Number: C144198; Vendor 1: LCSC; Part Name: MCP4725A0T-E/CH; CreatedBy: Judd Foster; HelpURL: https://datasheet.lcsc.com/lcsc/1811151442_Microchip-Tech-MCP4725A0T-E-CH_C144198.pdf; Manufacturer 1 Part Number: MCP4725A0T-E/CH
U?#13 = TL431BIDBZR: IC VREF SHUNT 36V 0.5% SOT23-3; Manufacturer 1: Texas Instruments; Vendor 1 Part Number: 296-18872-1-ND; Vendor 1: Digikey; Part Name: TL431BIDBZR; CreatedBy: Judd Foster; HelpURL: http://www.ti.com/lit/ds/symlink/tl431.pdf; Manufacturer 1 Part Number: TL431BIDBZR
U?#14 = TPS62932DRLR: Buck Switching Regulator IC Positive Adjustable 0.8V 1 Output 2A SOT-583; Manufacturer 1: Texas Instruments; Vendor 1 Part Number: 296-TPS62932DRLRCT-ND; Vendor 1: DigiKey; Part Name: TPS62932DRLR; CreatedBy: Judd Foster; HelpURL: https://www.ti.com/lit/ds/symlink/tps62932.pdf?ts=1695814293505&ref_url=https%253A%252F%252Fwww.ti.com%252Fsitesearch%252Fen-us%252Fdocs%252Funiversalsearch.tsp%253FlangPref%253Den-US%2526searchTerm%253DTPS62932DRLR%2526nr%253D12%2526login-check%253Dtrue; Manufacturer 1 Part Number: TPS62932DRLR